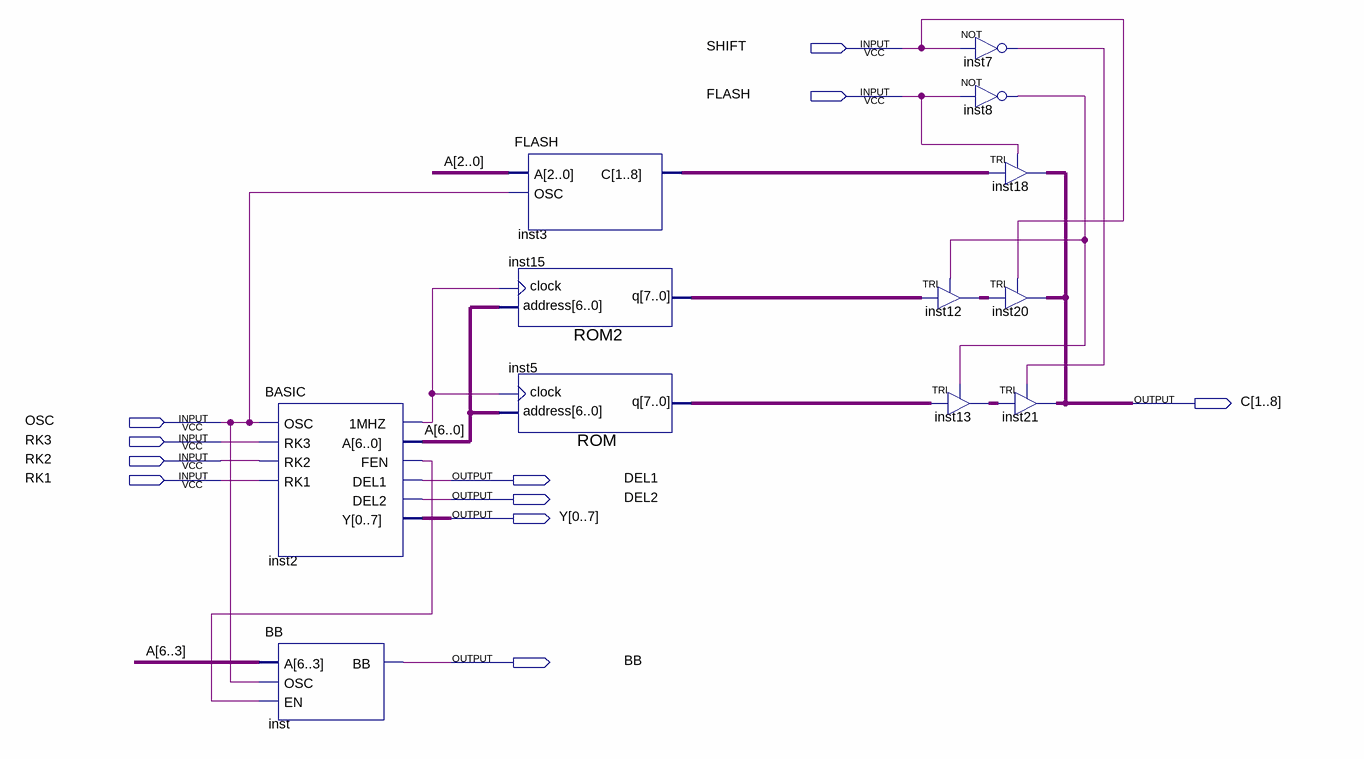
[diagram p0: schematic sheet]
// Quartus schematic FINAL.bdf as structural Verilog: 12 symbols, 11 pins
module FINAL (
  input  SHIFT,
  input  FLASH,
  input  OSC,
  input  RK3,
  input  RK2,
  input  RK1,
  output [1:8] C,
  output DEL1,
  output DEL2,
  output [0:7] Y,
  output BB
);

  wire inst2_1mhz, inst2_fen, inst7_out, inst8_out;
  wire [6:0] A;
  wire [7:0] inst3_c, inst5_q, inst12_out, inst13_out, inst15_q;

  BASIC inst2 (
    .OSC(OSC), .RK3(RK3), .RK2(RK2), .RK1(RK1), .\1MHZ (inst2_1mhz), .A(A), .FEN(inst2_fen), .DEL1(DEL1),
    .DEL2(DEL2), .Y(Y));
  BB inst (.A(A[6:3]), .OSC(OSC), .EN(inst2_fen), .BB(BB));
  FLASH inst3 (.A(A[2:0]), .OSC(OSC), .C(inst3_c));
  ROM2 inst15 (.address(A), .clock(inst2_1mhz), .q(inst15_q));
  ROM inst5 (.address(A), .clock(inst2_1mhz), .q(inst5_q));
  TRI inst12[7:0] (.IN(inst15_q), .OE(inst8_out), .OUT(inst12_out));
  TRI inst13[7:0] (.IN(inst5_q), .OE(inst8_out), .OUT(inst13_out));
  not inst7 (inst7_out, SHIFT);
  not inst8 (inst8_out, FLASH);
  TRI inst18[7:0] (.IN(inst3_c), .OE(FLASH), .OUT(C));
  TRI inst20[7:0] (.IN(inst12_out), .OE(SHIFT), .OUT(C));
  TRI inst21[7:0] (.IN(inst13_out), .OE(inst7_out), .OUT(C));
endmodule
